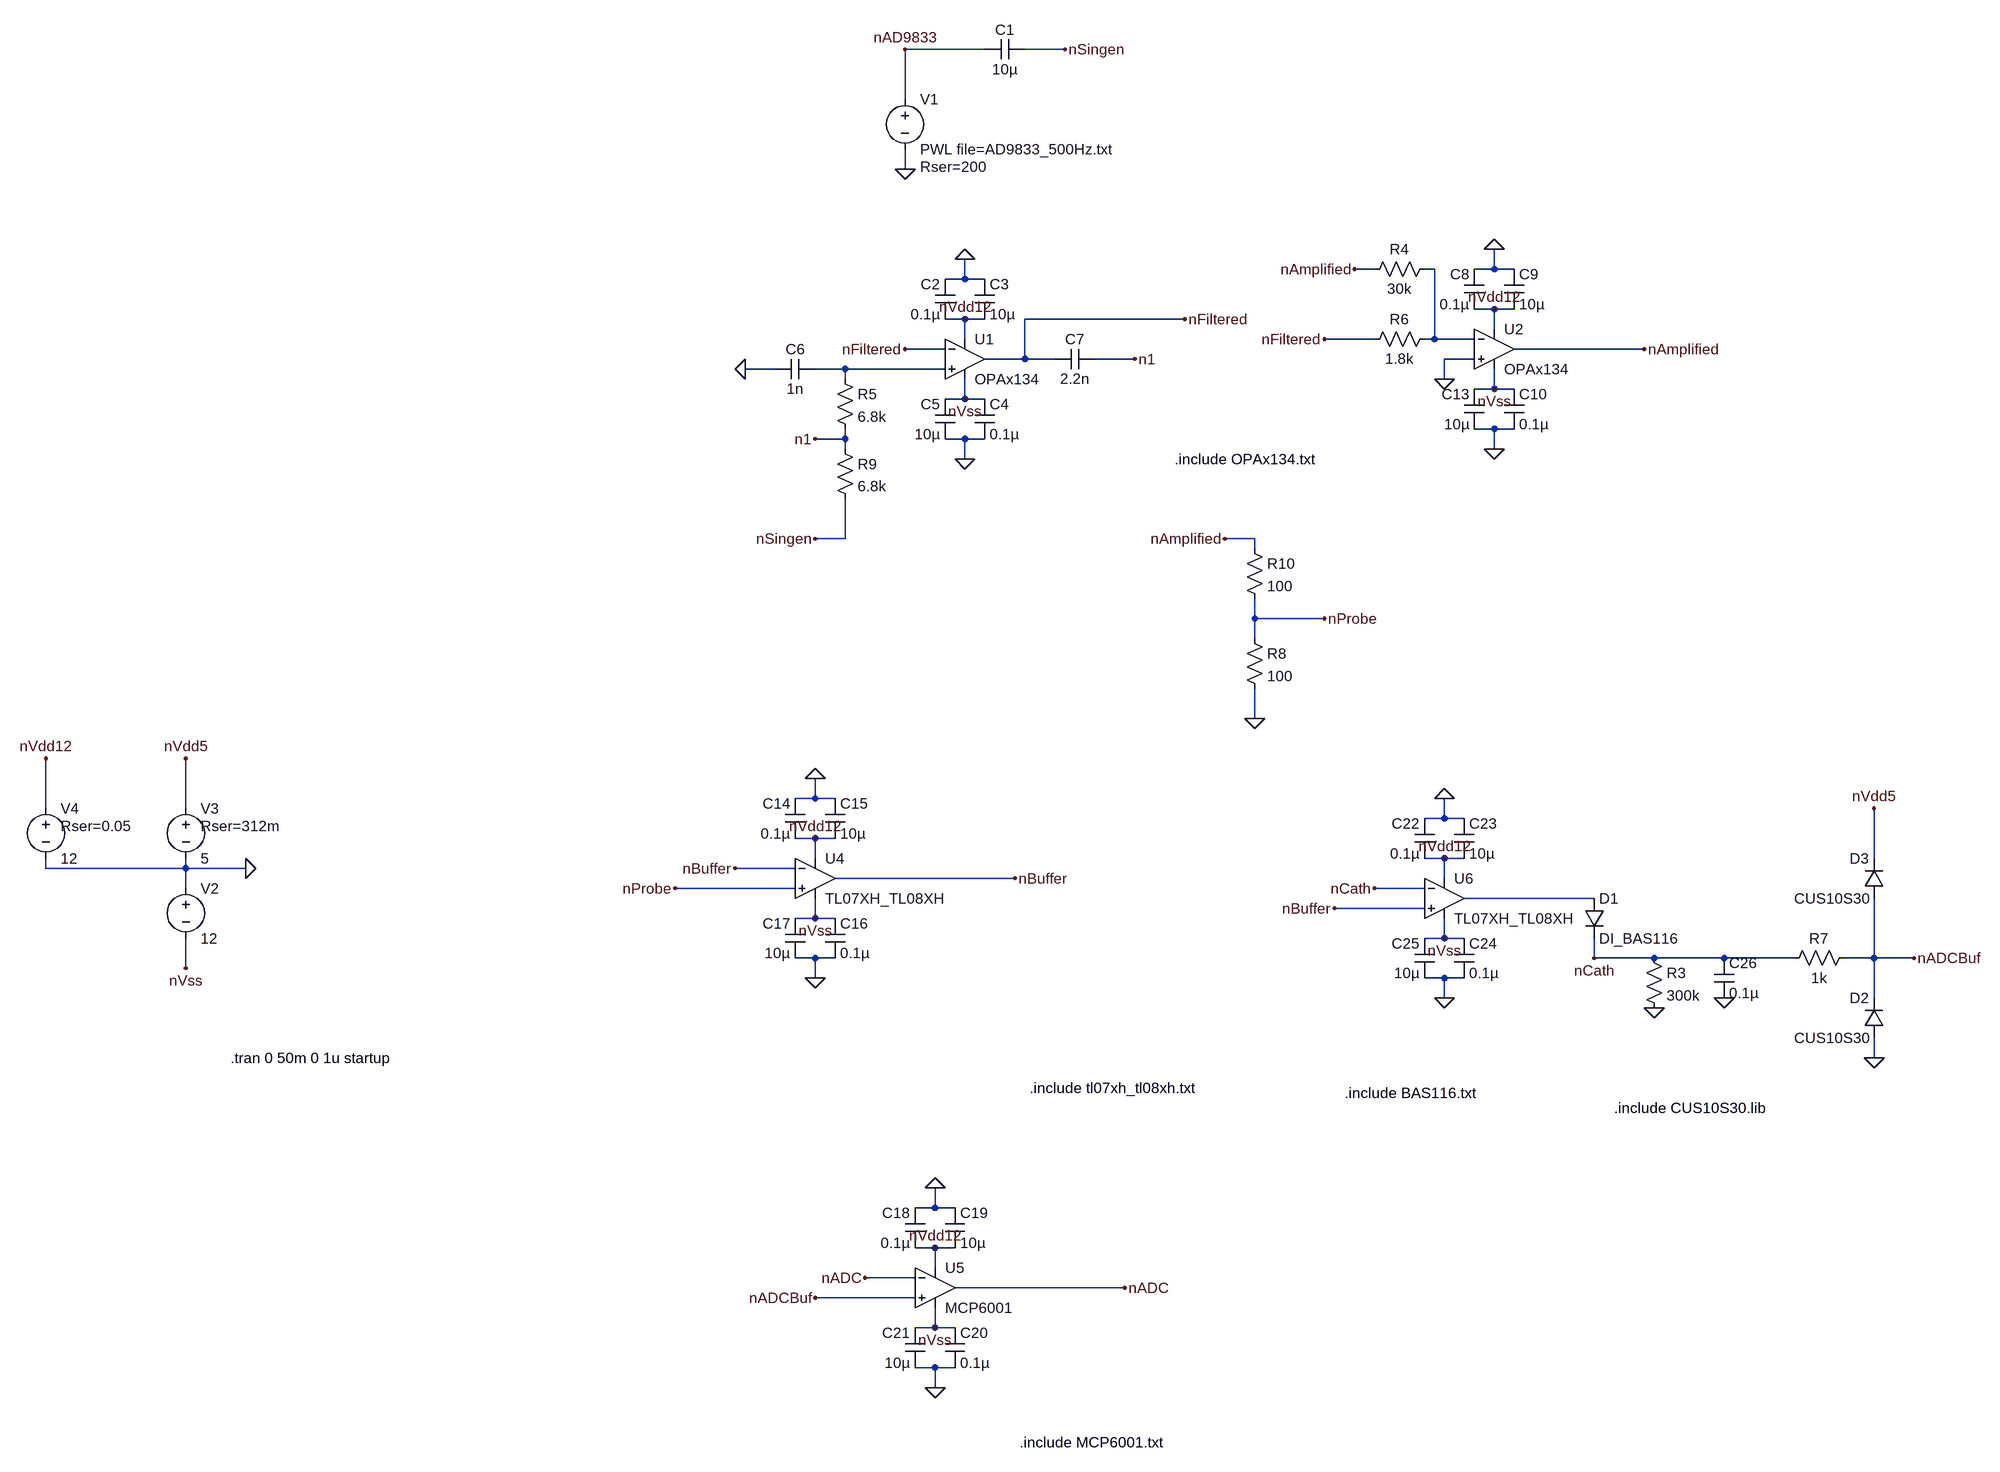
[diagram p0: schematic CircuitSimulation.asc]
CircuitSimulation.asc, the LTspice schematic file:
Version 4
SHEET 1 2020 2040
WIRE -48 -1568 -176 -1568
WIRE 80 -1568 16 -1568
WIRE -176 -1488 -176 -1568
WIRE -176 -1376 -176 -1408
WIRE 576 -1216 544 -1216
WIRE 672 -1216 656 -1216
WIRE 768 -1216 768 -1248
WIRE 768 -1216 736 -1216
WIRE 800 -1216 768 -1216
WIRE -80 -1200 -80 -1232
WIRE -80 -1200 -112 -1200
WIRE -48 -1200 -80 -1200
WIRE 768 -1152 736 -1152
WIRE 800 -1152 768 -1152
WIRE -80 -1136 -112 -1136
WIRE -48 -1136 -80 -1136
WIRE 272 -1136 16 -1136
WIRE 768 -1120 768 -1152
WIRE -80 -1104 -80 -1136
WIRE 576 -1104 496 -1104
WIRE 672 -1104 672 -1216
WIRE 672 -1104 656 -1104
WIRE 736 -1104 672 -1104
WIRE -112 -1088 -176 -1088
WIRE 1008 -1088 800 -1088
WIRE 16 -1072 16 -1136
WIRE 16 -1072 -48 -1072
WIRE 64 -1072 16 -1072
WIRE 192 -1072 128 -1072
WIRE 736 -1072 688 -1072
WIRE -384 -1056 -432 -1056
WIRE -272 -1056 -320 -1056
WIRE -112 -1056 -272 -1056
WIRE -272 -1040 -272 -1056
WIRE 688 -1040 688 -1072
WIRE 768 -1024 768 -1056
WIRE 768 -1024 736 -1024
WIRE 800 -1024 768 -1024
WIRE -80 -1008 -80 -1040
WIRE -80 -1008 -112 -1008
WIRE -48 -1008 -80 -1008
WIRE 768 -960 736 -960
WIRE 800 -960 768 -960
WIRE -272 -944 -272 -960
WIRE -272 -944 -320 -944
WIRE -80 -944 -112 -944
WIRE -48 -944 -80 -944
WIRE -272 -928 -272 -944
WIRE 768 -928 768 -960
WIRE -80 -912 -80 -944
WIRE -272 -784 -272 -848
WIRE -272 -784 -320 -784
WIRE 384 -784 336 -784
WIRE 384 -768 384 -784
WIRE 384 -656 384 -688
WIRE 496 -656 384 -656
WIRE 384 -624 384 -656
WIRE 384 -496 384 -544
WIRE -320 -368 -320 -400
WIRE -320 -368 -352 -368
WIRE -288 -368 -320 -368
WIRE -1552 -352 -1552 -432
WIRE -1328 -352 -1328 -432
WIRE 688 -336 688 -368
WIRE 688 -336 656 -336
WIRE 720 -336 688 -336
WIRE -320 -304 -352 -304
WIRE -288 -304 -320 -304
WIRE -320 -272 -320 -304
WIRE 688 -272 656 -272
WIRE 720 -272 688 -272
WIRE 1376 -272 1376 -352
WIRE -1552 -256 -1552 -272
WIRE -1328 -256 -1328 -272
WIRE -1328 -256 -1552 -256
WIRE -1232 -256 -1328 -256
WIRE -352 -256 -448 -256
WIRE 0 -240 -288 -240
WIRE 688 -240 688 -272
WIRE -1328 -224 -1328 -256
WIRE -352 -224 -544 -224
WIRE 656 -224 576 -224
WIRE 928 -208 720 -208
WIRE 656 -192 512 -192
WIRE -320 -176 -320 -208
WIRE -320 -176 -352 -176
WIRE -288 -176 -320 -176
WIRE 688 -144 688 -176
WIRE 688 -144 656 -144
WIRE 720 -144 688 -144
WIRE -320 -112 -352 -112
WIRE -288 -112 -320 -112
WIRE 928 -112 928 -144
WIRE 1024 -112 928 -112
WIRE 1136 -112 1024 -112
WIRE 1248 -112 1136 -112
WIRE 1376 -112 1376 -208
WIRE 1376 -112 1328 -112
WIRE 1440 -112 1376 -112
WIRE -1328 -96 -1328 -144
WIRE -320 -80 -320 -112
WIRE 688 -80 656 -80
WIRE 720 -80 688 -80
WIRE 688 -48 688 -80
WIRE 1376 -48 1376 -112
WIRE 1376 48 1376 16
WIRE -128 288 -128 256
WIRE -128 288 -160 288
WIRE -96 288 -128 288
WIRE -128 352 -160 352
WIRE -96 352 -128 352
WIRE -128 384 -128 352
WIRE -160 400 -240 400
WIRE 176 416 -96 416
WIRE -160 432 -320 432
WIRE -128 480 -128 448
WIRE -128 480 -160 480
WIRE -96 480 -128 480
WIRE -128 544 -160 544
WIRE -96 544 -128 544
WIRE -128 576 -128 544
FLAG -176 -1376 0
FLAG -176 -1568 nAD9833
FLAG 80 -1568 nSingen
FLAG -80 -1136 nVdd12
FLAG -80 -1008 nVss
FLAG 192 -1072 n1
FLAG 272 -1136 nFiltered
FLAG -432 -1056 0
FLAG -176 -1088 nFiltered
FLAG -320 -784 nSingen
FLAG -320 -944 n1
FLAG 768 -1152 nVdd12
FLAG 768 -1024 nVss
FLAG 688 -1040 0
FLAG 1008 -1088 nAmplified
FLAG 496 -1104 nFiltered
FLAG 544 -1216 nAmplified
FLAG 336 -784 nAmplified
FLAG 384 -496 0
FLAG 496 -656 nProbe
FLAG -320 -304 nVdd12
FLAG -320 -176 nVss
FLAG -128 352 nVdd12
FLAG -128 480 nVss
FLAG 688 -272 nVdd12
FLAG 688 -144 nVss
FLAG -544 -224 nProbe
FLAG -448 -256 nBuffer
FLAG 0 -240 nBuffer
FLAG 576 -224 nCath
FLAG 512 -192 nBuffer
FLAG 928 -112 nCath
FLAG 1136 -48 0
FLAG 1024 -32 0
FLAG 1376 48 0
FLAG 1376 -352 nVdd5
FLAG 1440 -112 nADCBuf
FLAG -320 432 nADCBuf
FLAG -240 400 nADC
FLAG 176 416 nADC
FLAG -80 -1232 0
FLAG -80 -912 0
FLAG 768 -1248 0
FLAG 768 -928 0
FLAG -320 -400 0
FLAG -320 -80 0
FLAG 688 -368 0
FLAG 688 -48 0
FLAG -128 256 0
FLAG -128 576 0
FLAG -1232 -256 0
FLAG -1328 -96 nVss
FLAG -1328 -432 nVdd5
FLAG -1552 -432 nVdd12
SYMBOL voltage -176 -1504 R0
WINDOW 123 0 0 Left 0
WINDOW 39 24 124 Left 2
SYMATTR SpiceLine Rser=200
SYMATTR InstName V1
SYMATTR Value PWL file=AD9833_500Hz.txt
SYMBOL cap 16 -1584 R90
WINDOW 0 0 32 VBottom 2
WINDOW 3 32 32 VTop 2
SYMATTR InstName C1
SYMATTR Value 10µ
SYMATTR SpiceLine V=10 Irms=1.25 Rser=5m
SYMBOL OpAmps\\opamp2 -80 -1136 R0
SYMATTR InstName U1
SYMATTR Value OPAx134
SYMBOL cap -96 -1136 R180
WINDOW 0 24 56 Left 2
WINDOW 3 24 8 Left 2
SYMATTR InstName C2
SYMATTR Value 0.1µ
SYMATTR SpiceLine V=16 Irms=0.6 Rser=0.05
SYMBOL cap -64 -1200 R0
SYMATTR InstName C3
SYMATTR Value 10µ
SYMATTR SpiceLine V=10 Irms=1.25 Rser=5m
SYMBOL cap -64 -1008 R0
SYMATTR InstName C4
SYMATTR Value 0.1µ
SYMATTR SpiceLine V=16 Irms=0.6 Rser=0.05
SYMBOL cap -96 -944 R180
WINDOW 0 24 56 Left 2
WINDOW 3 24 8 Left 2
SYMATTR InstName C5
SYMATTR Value 10µ
SYMATTR SpiceLine V=10 Irms=1.25 Rser=5m
SYMBOL cap -320 -1072 R90
WINDOW 0 0 32 VBottom 2
WINDOW 3 32 32 VTop 2
SYMATTR InstName C6
SYMATTR Value 1n
SYMATTR SpiceLine V=50 Irms=0.2 Rser=300m
SYMBOL cap 128 -1088 R90
WINDOW 0 0 32 VBottom 2
WINDOW 3 32 32 VTop 2
SYMATTR InstName C7
SYMATTR Value 2.2n
SYMATTR SpiceLine V=50 Irms=0.15 Rser=250m
SYMBOL res 1008 -128 R0
SYMATTR InstName R3
SYMATTR Value 300k
SYMATTR SpiceLine tol=1 pwr=0.25
SYMBOL res 672 -1232 R90
WINDOW 0 0 56 VBottom 2
WINDOW 3 32 56 VTop 2
SYMATTR InstName R4
SYMATTR Value 30k
SYMATTR SpiceLine tol=1 pwr=0.25
SYMBOL res -288 -1056 R0
SYMATTR InstName R5
SYMATTR Value 6.8k
SYMATTR SpiceLine tol=1 pwr=0.25
SYMBOL res 672 -1120 R90
WINDOW 0 0 56 VBottom 2
WINDOW 3 32 56 VTop 2
SYMATTR InstName R6
SYMATTR Value 1.8k
SYMATTR SpiceLine tol=1 pwr=0.25
SYMBOL res 1344 -128 R90
WINDOW 0 0 56 VBottom 2
WINDOW 3 32 56 VTop 2
SYMATTR InstName R7
SYMATTR Value 1k
SYMATTR SpiceLine tol=1 pwr=0.25
SYMBOL res 368 -640 R0
SYMATTR InstName R8
SYMATTR Value 100
SYMATTR SpiceLine tol=1 pwr=0.5
SYMBOL res -288 -944 R0
SYMATTR InstName R9
SYMATTR Value 6.8k
SYMATTR SpiceLine tol=1 pwr=0.25
SYMBOL OpAmps\\opamp2 768 -1152 R0
SYMATTR InstName U2
SYMATTR Value OPAx134
SYMBOL cap 752 -1152 R180
WINDOW 0 24 56 Left 2
WINDOW 3 24 8 Left 2
SYMATTR InstName C8
SYMATTR Value 0.1µ
SYMATTR SpiceLine V=16 Irms=0.6 Rser=0.05
SYMBOL cap 784 -1216 R0
SYMATTR InstName C9
SYMATTR Value 10µ
SYMATTR SpiceLine V=10 Irms=1.25 Rser=5m
SYMBOL cap 784 -1024 R0
SYMATTR InstName C10
SYMATTR Value 0.1µ
SYMATTR SpiceLine V=16 Irms=0.6 Rser=0.05
SYMBOL cap 752 -960 R180
WINDOW 0 24 56 Left 2
WINDOW 3 24 8 Left 2
SYMATTR InstName C13
SYMATTR Value 10µ
SYMATTR SpiceLine V=10 Irms=1.25 Rser=5m
SYMBOL res 368 -784 R0
SYMATTR InstName R10
SYMATTR Value 100
SYMBOL OpAmps\\opamp2 -320 -304 R0
SYMATTR InstName U4
SYMATTR Value TL07XH_TL08XH
SYMBOL cap -336 -304 R180
WINDOW 0 24 56 Left 2
WINDOW 3 24 8 Left 2
SYMATTR InstName C14
SYMATTR Value 0.1µ
SYMATTR SpiceLine V=16 Irms=0.6 Rser=0.05
SYMBOL cap -304 -368 R0
SYMATTR InstName C15
SYMATTR Value 10µ
SYMATTR SpiceLine V=10 Irms=1.25 Rser=5m
SYMBOL cap -304 -176 R0
SYMATTR InstName C16
SYMATTR Value 0.1µ
SYMATTR SpiceLine V=16 Irms=0.6 Rser=0.05
SYMBOL cap -336 -112 R180
WINDOW 0 24 56 Left 2
WINDOW 3 24 8 Left 2
SYMATTR InstName C17
SYMATTR Value 10µ
SYMATTR SpiceLine V=10 Irms=1.25 Rser=5m
SYMBOL OpAmps\\opamp2 -128 352 R0
SYMATTR InstName U5
SYMATTR Value MCP6001
SYMBOL cap -144 352 R180
WINDOW 0 24 56 Left 2
WINDOW 3 24 8 Left 2
SYMATTR InstName C18
SYMATTR Value 0.1µ
SYMATTR SpiceLine V=16 Irms=0.6 Rser=0.05
SYMBOL cap -112 288 R0
SYMATTR InstName C19
SYMATTR Value 10µ
SYMATTR SpiceLine V=10 Irms=1.25 Rser=5m
SYMBOL cap -112 480 R0
SYMATTR InstName C20
SYMATTR Value 0.1µ
SYMATTR SpiceLine V=16 Irms=0.6 Rser=0.05
SYMBOL cap -144 544 R180
WINDOW 0 24 56 Left 2
WINDOW 3 24 8 Left 2
SYMATTR InstName C21
SYMATTR Value 10µ
SYMATTR SpiceLine V=10 Irms=1.25 Rser=5m
SYMBOL OpAmps\\opamp2 688 -272 R0
SYMATTR InstName U6
SYMATTR Value TL07XH_TL08XH
SYMBOL cap 672 -272 R180
WINDOW 0 24 56 Left 2
WINDOW 3 24 8 Left 2
SYMATTR InstName C22
SYMATTR Value 0.1µ
SYMATTR SpiceLine V=16 Irms=0.6 Rser=0.05
SYMBOL cap 704 -336 R0
SYMATTR InstName C23
SYMATTR Value 10µ
SYMATTR SpiceLine V=10 Irms=1.25 Rser=5m
SYMBOL cap 704 -144 R0
SYMATTR InstName C24
SYMATTR Value 0.1µ
SYMATTR SpiceLine V=16 Irms=0.6 Rser=0.05
SYMBOL cap 672 -80 R180
WINDOW 0 24 56 Left 2
WINDOW 3 24 8 Left 2
SYMATTR InstName C25
SYMATTR Value 10µ
SYMATTR SpiceLine V=10 Irms=1.25 Rser=5m
SYMBOL diode 912 -208 R0
SYMATTR InstName D1
SYMATTR Value DI_BAS116
SYMBOL diode 1392 16 R180
WINDOW 0 24 64 Left 2
WINDOW 3 24 0 Left 2
SYMATTR InstName D2
SYMATTR Value CUS10S30
SYMATTR Prefix X
SYMBOL cap 1120 -112 R0
SYMATTR InstName C26
SYMATTR Value 0.1µ
SYMATTR SpiceLine V=16 Irms=0.6 Rser=0.05
SYMBOL diode 1392 -208 R180
WINDOW 0 24 64 Left 2
WINDOW 3 24 0 Left 2
SYMATTR InstName D3
SYMATTR Value CUS10S30
SYMATTR Prefix X
SYMBOL voltage -1328 -240 R0
WINDOW 123 0 0 Left 0
WINDOW 39 0 0 Left 0
SYMATTR InstName V2
SYMATTR Value 12
SYMBOL voltage -1328 -368 R0
WINDOW 123 0 0 Left 0
WINDOW 39 24 44 Left 2
SYMATTR SpiceLine Rser=312m
SYMATTR InstName V3
SYMATTR Value 5
SYMBOL voltage -1552 -368 R0
WINDOW 123 0 0 Left 0
WINDOW 39 24 44 Left 2
SYMATTR SpiceLine Rser=0.05
SYMATTR InstName V4
SYMATTR Value 12
TEXT -1256 48 Left 2 !.tran 0 50m 0 1u startup
TEXT 256 -912 Left 2 !.include OPAx134.txt
TEXT 528 104 Left 2 !.include BAS116.txt
TEXT 960 128 Left 2 !.include CUS10S30.lib
TEXT 8 664 Left 2 !.include MCP6001.txt
TEXT 24 96 Left 2 !.include tl07xh_tl08xh.txt

The netlist it stands for:
* CircuitSimulation.asc
V1 nAD9833 0 PWL file=AD9833_500Hz.txt Rser=200
C1 nSingen nAD9833 10µ V=10 Irms=1.25 Rser=5m
XU1 N002 nFiltered nVdd12 nVss nFiltered OPAx134  ; pins In+ In- V+ V- OUT
C2 nVdd12 0 0.1µ V=16 Irms=0.6 Rser=0.05
C3 0 nVdd12 10µ V=10 Irms=1.25 Rser=5m
C4 nVss 0 0.1µ V=16 Irms=0.6 Rser=0.05
C5 0 nVss 10µ V=10 Irms=1.25 Rser=5m
C6 N002 0 1n V=50 Irms=0.2 Rser=300m
C7 n1 nFiltered 2.2n V=50 Irms=0.15 Rser=250m
R3 nCath 0 300k tol=1 pwr=0.25
R4 N001 nAmplified 30k tol=1 pwr=0.25
R5 N002 n1 6.8k tol=1 pwr=0.25
R6 N001 nFiltered 1.8k tol=1 pwr=0.25
R7 nADCBuf nCath 1k tol=1 pwr=0.25
R8 nProbe 0 100 tol=1 pwr=0.5
R9 n1 nSingen 6.8k tol=1 pwr=0.25
XU2 0 N001 nVdd12 nVss nAmplified OPAx134  ; pins In+ In- V+ V- OUT
C8 nVdd12 0 0.1µ V=16 Irms=0.6 Rser=0.05
C9 0 nVdd12 10µ V=10 Irms=1.25 Rser=5m
C10 nVss 0 0.1µ V=16 Irms=0.6 Rser=0.05
C13 0 nVss 10µ V=10 Irms=1.25 Rser=5m
R10 nAmplified nProbe 100
XU4 nProbe nBuffer nVdd12 nVss nBuffer TL07XH_TL08XH  ; pins In+ In- V+ V- OUT
C14 nVdd12 0 0.1µ V=16 Irms=0.6 Rser=0.05
C15 0 nVdd12 10µ V=10 Irms=1.25 Rser=5m
C16 nVss 0 0.1µ V=16 Irms=0.6 Rser=0.05
C17 0 nVss 10µ V=10 Irms=1.25 Rser=5m
XU5 nADCBuf nADC nVdd12 nVss nADC MCP6001  ; pins In+ In- V+ V- OUT
C18 nVdd12 0 0.1µ V=16 Irms=0.6 Rser=0.05
C19 0 nVdd12 10µ V=10 Irms=1.25 Rser=5m
C20 nVss 0 0.1µ V=16 Irms=0.6 Rser=0.05
C21 0 nVss 10µ V=10 Irms=1.25 Rser=5m
XU6 nBuffer nCath nVdd12 nVss N003 TL07XH_TL08XH  ; pins In+ In- V+ V- OUT
C22 nVdd12 0 0.1µ V=16 Irms=0.6 Rser=0.05
C23 0 nVdd12 10µ V=10 Irms=1.25 Rser=5m
C24 nVss 0 0.1µ V=16 Irms=0.6 Rser=0.05
C25 0 nVss 10µ V=10 Irms=1.25 Rser=5m
D1 N003 nCath DI_BAS116
XD2 0 nADCBuf CUS10S30  ; pins + -
C26 nCath 0 0.1µ V=16 Irms=0.6 Rser=0.05
XD3 nADCBuf nVdd5 CUS10S30  ; pins + -
V2 0 nVss 12
V3 nVdd5 0 5 Rser=312m
V4 nVdd12 0 12 Rser=0.05
.model D D
.lib standard.dio
.tran 0 50m 0 1u startup
.include OPAx134.txt
.include BAS116.txt
.include CUS10S30.lib
.include MCP6001.txt
.include tl07xh_tl08xh.txt
.backanno
.end